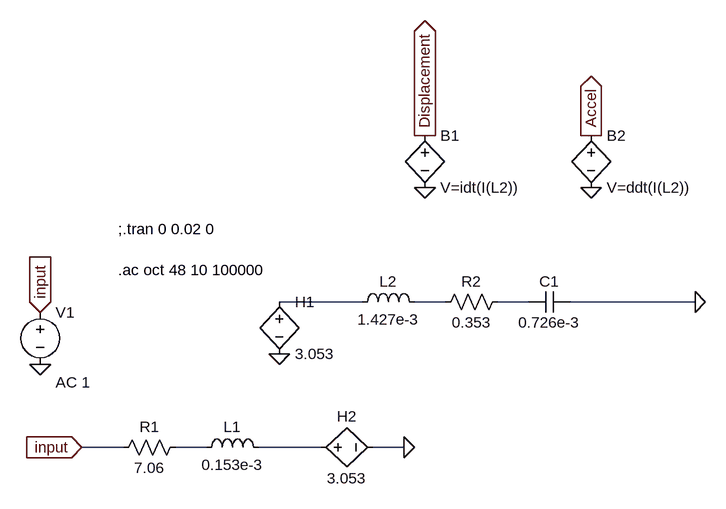
[diagram p0: schematic demo_02.asc]
demo_02.asc, the LTspice schematic file:
Version 4
SHEET 1 1060 680
WIRE 528 112 400 112
WIRE 656 112 608 112
WIRE 784 112 736 112
WIRE 1040 112 848 112
WIRE 160 336 96 336
WIRE 288 336 240 336
WIRE 464 336 368 336
WIRE 592 336 544 336
FLAG 32 208 0
FLAG 32 128 input
IOPIN 32 128 In
FLAG 592 336 0
FLAG 96 336 input
IOPIN 96 336 In
FLAG 1040 112 0
FLAG 624 -64 0
FLAG 880 -64 0
FLAG 624 -144 Displacement
IOPIN 624 -144 Out
FLAG 880 -144 Accel
IOPIN 880 -144 Out
FLAG 400 192 0
SYMBOL voltage 32 112 R0
WINDOW 123 24 124 Left 2
WINDOW 39 0 0 Left 0
SYMATTR Value2 AC 1
SYMATTR InstName V1
SYMATTR Value ""
SYMBOL res 144 352 R270
WINDOW 0 32 56 VTop 2
WINDOW 3 0 56 VBottom 2
SYMATTR InstName R1
SYMATTR Value 7.06
SYMBOL ind 272 352 R270
WINDOW 0 32 56 VTop 2
WINDOW 3 5 56 VBottom 2
SYMATTR InstName L1
SYMATTR Value 0.153e-3
SYMBOL ind 512 128 R270
WINDOW 0 32 56 VTop 2
WINDOW 3 5 56 VBottom 2
SYMATTR InstName L2
SYMATTR Value 1.427e-3
SYMBOL res 640 128 R270
WINDOW 0 32 56 VTop 2
WINDOW 3 0 56 VBottom 2
SYMATTR InstName R2
SYMATTR Value 0.353
SYMBOL cap 784 128 R270
WINDOW 0 32 32 VTop 2
WINDOW 3 0 32 VBottom 2
SYMATTR InstName C1
SYMATTR Value 0.726e-3
SYMBOL bv 624 -160 R0
SYMATTR InstName B1
SYMATTR Value V=idt(I(L2))
SYMBOL bv 880 -160 R0
SYMATTR InstName B2
SYMATTR Value V=ddt(I(L2))
SYMBOL h 400 96 R0
SYMATTR InstName H1
SYMATTR Value 3.053
SYMATTR SpiceModel L1
SYMBOL h 448 336 R270
WINDOW 0 32 56 VTop 2
WINDOW 3 -32 56 VBottom 2
SYMATTR InstName H2
SYMATTR Value 3.053
SYMATTR SpiceModel L2
TEXT 152 0 Left 2 !;.tran 0 0.02 0\n\n.ac oct 48 10 100000

The netlist it stands for:
* demo_02.asc
V1 input 0 AC 1
R1 input N004 7.06
L1 N004 N005 0.153e-3
L2 N001 N002 1.427e-3
R2 N002 N003 0.353
C1 N003 0 0.726e-3
B1 Displacement 0 V=idt(I(L2))
B2 Accel 0 V=ddt(I(L2))
H1 N001 0 L1 3.053
H2 N005 0 L2 3.053
;.tran 0 0.02 0
.ac oct 48 10 100000
.backanno
.end

* Results of the author's LTspice run, read from the files saved beside the schematic
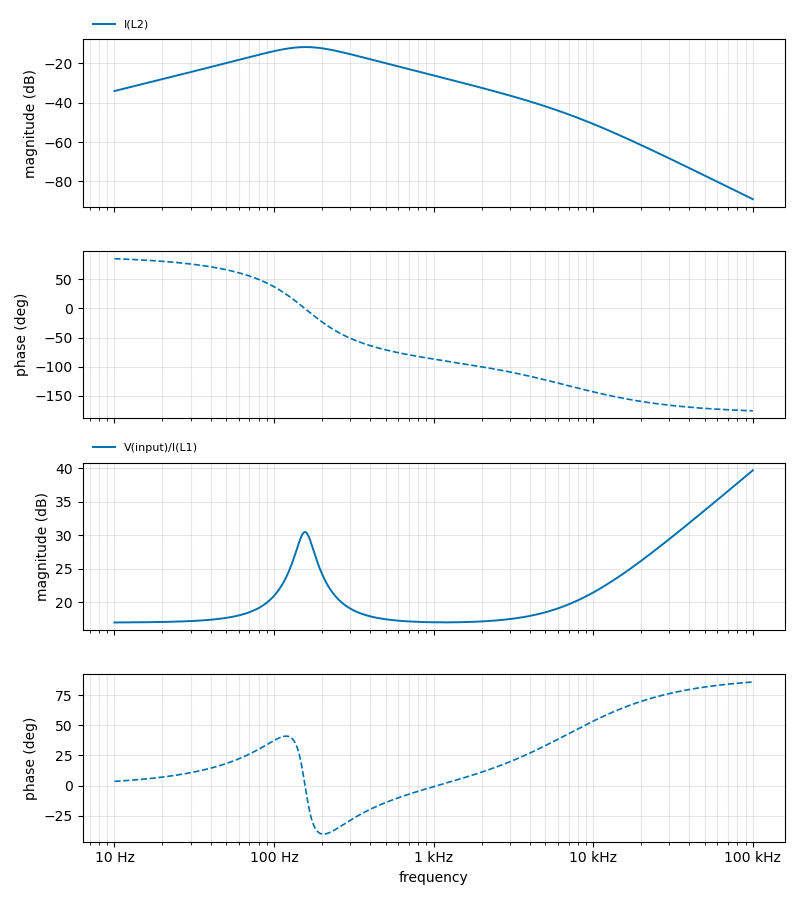
[diagram p1: AC Analysis of demo_02.asc, plotted from the saved traces]
* AC Analysis, 1 run:
*   I(L2): -34.09 dB at 10 Hz, -89.04 dB at 100 kHz, peak -11.75 dB at 157.7 Hz, 3 dB below the peak at 89.23 Hz and 279.6 Hz
*   V(input)/I(L1): 17.00 dB at 10 Hz, 39.68 dB at 100 kHz, peak 39.68 dB at 100 kHz, 3 dB below the peak at 70.53 kHz